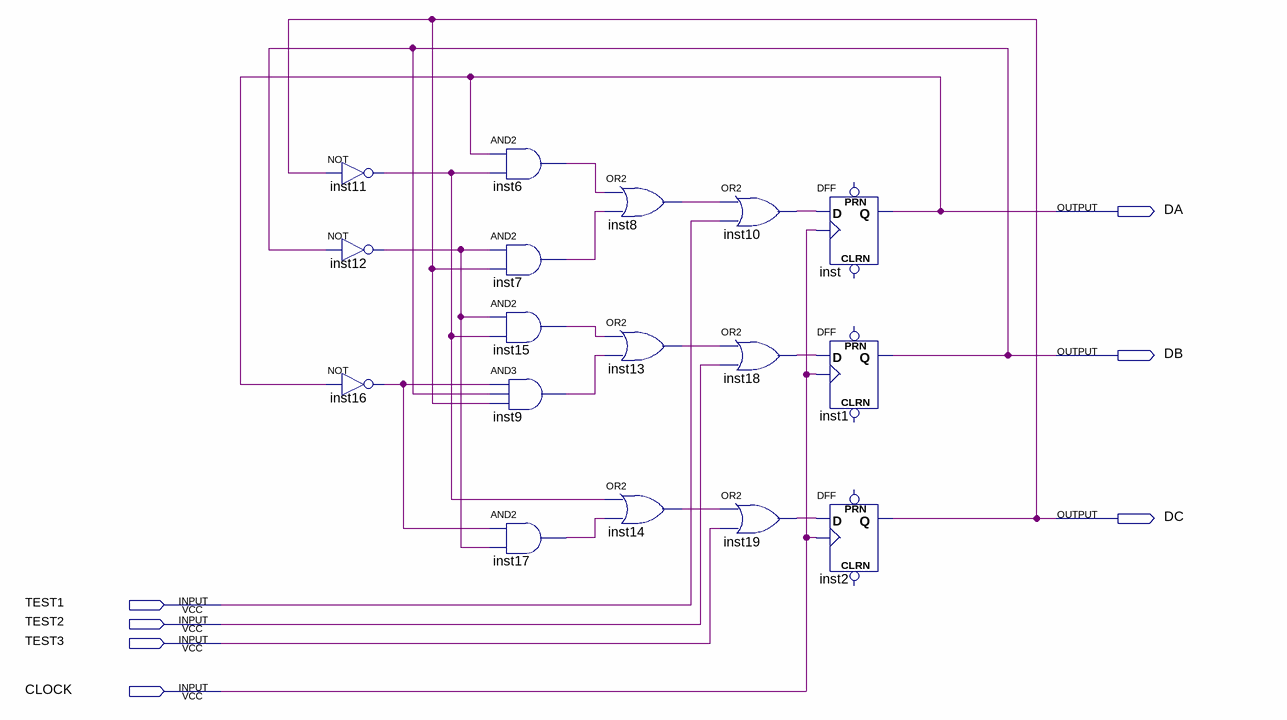
[diagram p0: schematic sheet]
// Quartus schematic counter_with_sequence.bdf as structural Verilog: 17 symbols, 7 pins
module counter_with_sequence (
  input  TEST1,
  input  TEST2,
  input  TEST3,
  input  CLOCK,
  output DA,
  output DB,
  output DC
);

  wire inst6_out, inst7_out, inst8_out, inst9_out, inst10_out, inst11_out, inst12_out, inst13_out,
       inst14_out, inst15_out, inst16_out, inst17_out, inst18_out, inst19_out;

  not inst11 (inst11_out, DC);
  not inst12 (inst12_out, DB);
  not inst16 (inst16_out, DA);
  and inst6 (inst6_out, DA, inst11_out);
  and inst7 (inst7_out, inst12_out, DC);
  and inst15 (inst15_out, inst12_out, inst11_out);
  and inst9 (inst9_out, inst16_out, DB, DC);
  and inst17 (inst17_out, inst16_out, inst12_out);
  or inst8 (inst8_out, inst6_out, inst7_out);
  or inst13 (inst13_out, inst15_out, inst9_out);
  or inst14 (inst14_out, inst11_out, inst17_out);
  or inst10 (inst10_out, inst8_out, TEST1);
  or inst18 (inst18_out, inst13_out, TEST2);
  or inst19 (inst19_out, inst14_out, TEST3);
  DFF inst (.CLK(CLOCK), .D(inst10_out), .Q(DA));  // open: CLRN, PRN
  DFF inst1 (.CLK(CLOCK), .D(inst18_out), .Q(DB));  // open: CLRN, PRN
  DFF inst2 (.CLK(CLOCK), .D(inst19_out), .Q(DC));  // open: CLRN, PRN
endmodule
